# Altium schematic sheet Mechanical.SchDoc: Mechanical
size A4; Author: Samuel López; DrawnBy: Samuel López; DocumentNumber: 6; SheetNumber: 6; SheetTotal: 6
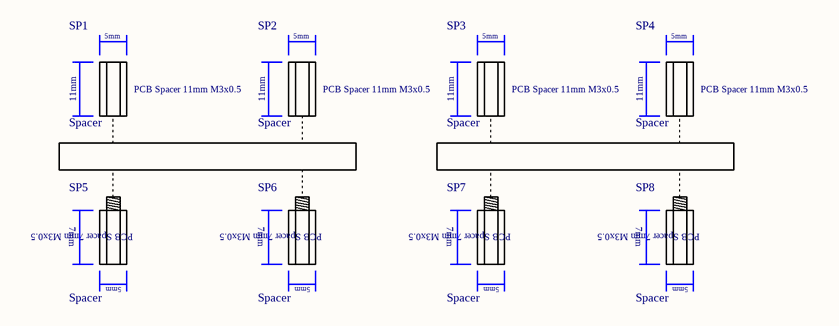
[diagram p0: Mechanical.SchDoc]

## Parts
SP1  Spacer  [Spacer 11mm M3x0.5]
SP2  Spacer  [Spacer 11mm M3x0.5]
SP3  Spacer  [Spacer 11mm M3x0.5]
SP4  Spacer  [Spacer 11mm M3x0.5]
SP5  Spacer  [Spacer 7mm M3x0.5 Screw]
SP6  Spacer  [Spacer 7mm M3x0.5 Screw]
SP7  Spacer  [Spacer 7mm M3x0.5 Screw]
SP8  Spacer  [Spacer 7mm M3x0.5 Screw]

## Notes on the sheet
- (in symbol Spacer 7mm M3x0.5 Screw) 7mm; PCB Spacer 7mm M3x0.5; 5mm
- (in symbol Spacer 11mm M3x0.5) 5mm; 11mm

## Library data of the parts
SP1-SP4 = Spacer 11mm M3x0.5: PCB Spacer 11mm M3x0.5; Supplier 1: Digi-Key; Supplier Part Number 1: 952-2312-ND
SP5-SP8 = Spacer 7mm M3x0.5 Screw: PCB Spacer 7mm M3x0.5 Screw; Supplier 1: Digi-Key; Supplier Part Number 1: 952-1498-ND